# Altium project 51MCU最小系统.PrjPCB
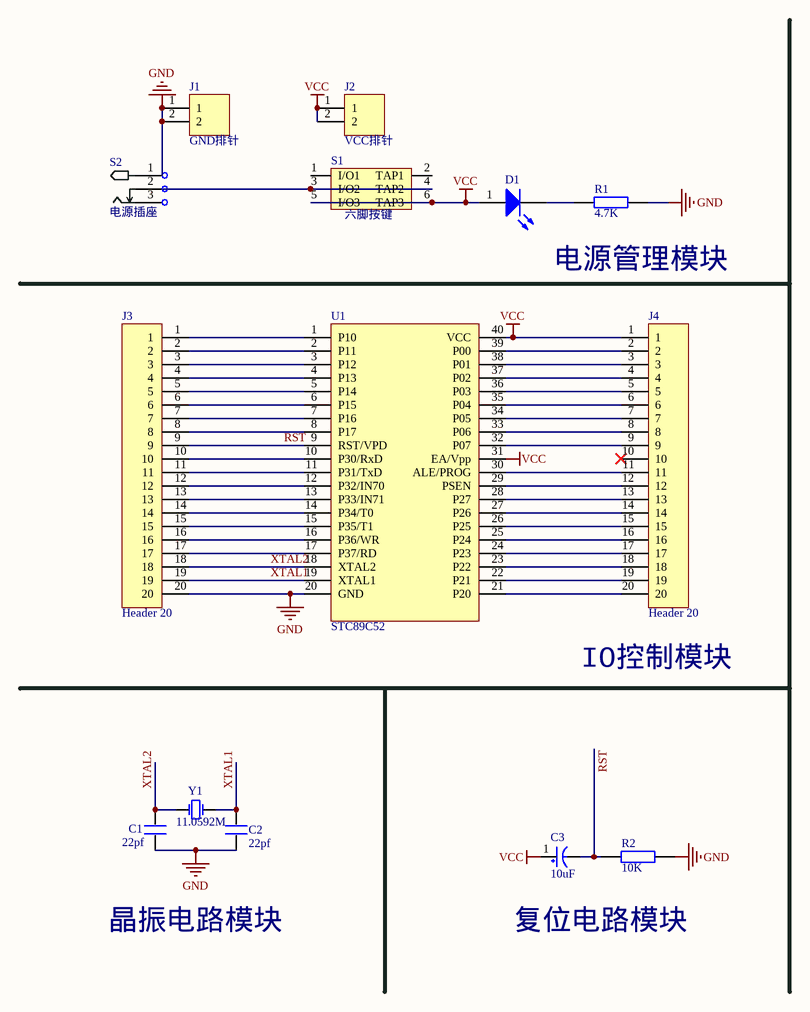
[diagram p0: 51MCU最小系统.SchDoc]
1 sheet, 14 parts. Net scope: global (net labels, ports and power ports of the same name join across sheets).
Board file: 51MCU最小系统.PcbDoc

## Sheet 51MCU最小系统.SchDoc
size A4

### Parts
C1  22pf  [CAP_2.54_NO_ele]
C2  22pf  [CAP_2.54_NO_ele]
C3  10uF  [Cap_3.0]
D1  LED-Diode-DIP  [LED_DIP]  (value not drawn)
J1  GND排针  [Header 2]
J2  VCC排针  [Header 2]
J3  Header 20  [Header 20]
J4  Header 20  [Header 20]
R1  4.7K  [Res-dip - duplicate]
R2  10K  [Res-dip - duplicate]
S1  六脚按键  [Key-6]
S2  电源插座  [DC-005]
U1  STC89C52  [DIP-40]
Y1  11.0592M  [XTAL_SOP]

### Nets
GND: C1.2 C2.2 J1.1 J1.2 J3.20 R1.2 R2.1 S2.1 U1.20(GND)
VCC: C3.1(VCC) D1.1(A) J2.1 J2.2 J4.1 S1.5(I/O3) S1.6(TAP3) U1.31(EA/Vpp) U1.40(VCC)
RST: C3.2(GND) J3.9 R2.2 U1.9(RST/VPD)
XTAL1: C2.1 J3.19 U1.19(XTAL1) Y1.1(OSC1)
XTAL2: C1.1 J3.18 U1.18(XTAL2) Y1.2(OSC2)
NetD1_2: D1.2(K) R1.1
NetJ3_1: J3.1 U1.1(P10)
NetJ3_2: J3.2 U1.2(P11)
NetJ3_3: J3.3 U1.3(P12)
NetJ3_4: J3.4 U1.4(P13)
NetJ3_5: J3.5 U1.5(P14)
NetJ3_6: J3.6 U1.6(P15)
NetJ3_7: J3.7 U1.7(P16)
NetJ3_8: J3.8 U1.8(P17)
NetJ3_10: J3.10 U1.10(P30/RxD)
NetJ3_11: J3.11 U1.11(P31/TxD)
NetJ3_12: J3.12 U1.12(P32/IN70)
NetJ3_13: J3.13 U1.13(P33/IN71)
NetJ3_14: J3.14 U1.14(P34/T0)
NetJ3_15: J3.15 U1.15(P35/T1)
NetJ3_16: J3.16 U1.16(P36/WR)
NetJ3_17: J3.17 U1.17(P37/RD)
NetJ4_2: J4.2 U1.39(P00)
NetJ4_3: J4.3 U1.38(P01)
NetJ4_4: J4.4 U1.37(P02)
NetJ4_5: J4.5 U1.36(P03)
NetJ4_6: J4.6 U1.35(P04)
NetJ4_7: J4.7 U1.34(P05)
NetJ4_8: J4.8 U1.33(P06)
NetJ4_9: J4.9 U1.32(P07)
NetJ4_11: J4.11 U1.30(ALE/PROG)
NetJ4_12: J4.12 U1.29(PSEN)
NetJ4_13: J4.13 U1.28(P27)
NetJ4_14: J4.14 U1.27(P26)
NetJ4_15: J4.15 U1.26(P25)
NetJ4_16: J4.16 U1.25(P24)
NetJ4_17: J4.17 U1.24(P23)
NetJ4_18: J4.18 U1.23(P22)
NetJ4_19: J4.19 U1.22(P21)
NetJ4_20: J4.20 U1.21(P20)
NetS1_3: S1.3(I/O2) S1.4(TAP2) S2.2

Not connected (* = marked no-connect by the designer): J4 10*; S1 1(I/O1) 2(TAP1); S2 3

### Notes on the sheet
- 电源管理模块
- (near J4) IO控制模块
- 晶振电路模块
- 复位电路模块

### Library data of the parts
C1 C2 = C-dip
C3 = C-ele
J1 J2 = Header 2
R1 R2 = Res-DIP
S1 = KEY-6
S2 = DC-005
Y1 = XTAL